# Altium schematic sheet EEPROM.SchDoc: I2C EEprom
size A4; DocumentNumber: 53; SheetNumber: 53; SheetTotal: 54
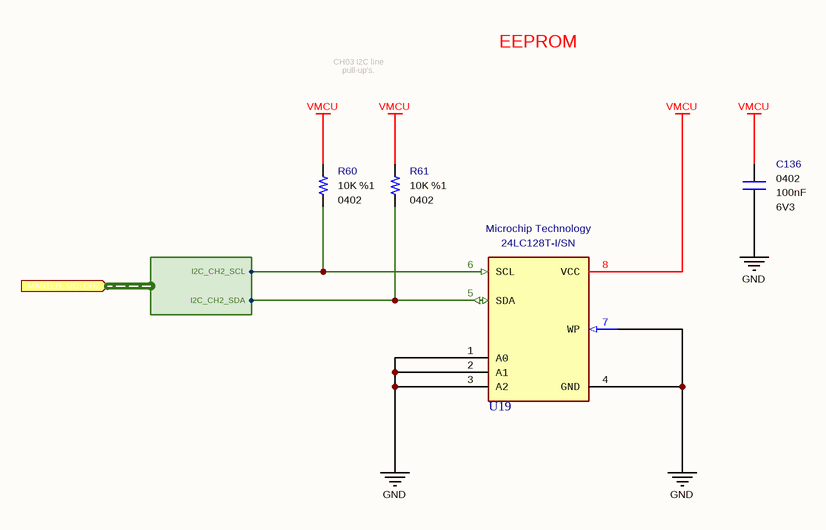
[diagram p0: EEPROM.SchDoc]

## Parts
C136  value 100nF  Case: 0402  Voltage: 6V3  [CAPACITOR_0402]  (hidden comment: Multilayer Ceramic Capacitor)
R60  value 10K  Tolerance: %1  Case: 0402  [RESISTOR_0402]  (hidden comment: Thick Film Resistor)
R61  value 10K  Tolerance: %1  Case: 0402  [RESISTOR_0402]  (hidden comment: Thick Film Resistor)
U19  Manufacturer Part Number: 24LC128T-I/SN  Manufacturer Name: Microchip Technology  [SOIC-8]  (hidden comment: EEPROM)

## Ports
MASTER_I2C_CH2 (in, harness MASTER_I2C_CH2)

## Harnesses
MASTER_I2C_CH2: I2C_CH2_SDA, I2C_CH2_SCL

## Nets
GND: C136.1 U19.1(A0) U19.2(A1) U19.3(A2) U19.4(GND) U19.7(WP)
VMCU: C136.2 R60.2 R61.2 U19.8(VCC)
NetR60_1: R60.1 U19.6(SCL) ; port MASTER_I2C_CH2.I2C_CH2_SCL
NetR61_1: R61.1 U19.5(SDA) ; port MASTER_I2C_CH2.I2C_CH2_SDA

## Notes on the sheet
- EEPROM
- CH03 I2C line pull-up's.
- Engineer
- All Rights are reserved to Customer and Engineer. [2021]
- Size:
- Date:
- A4
- Project :
- Time:
- Sheet
- of
- Customer
- Product ID
- Module ID
- Version
- File:
- Revision

## Library data of the parts
C136 = Capacitor - 100nF [0402-6V3]: Capacitor - 100nF [0402-6V3] (Ceramic); Manufacturer Name: AVX; Manufacturer Part Number: 04026D104KAT4A; Dielectric: X5R; Tolerance: %10; Height: 0.25mm; ComponentLink1Description: Mouser; ComponentLink1URL: https://www.mouser.com.tr/ProductDetail/AVX/04026D104KAT4A?qs=sGAEpiMZZMs0AnBnWHyRQPg4iYkCw7IMED%2F4kpqgf7w%3D; ComponentLink2Description: DataSheet; ComponentLink2URL: https://www.mouser.com.tr/datasheet/2/40/cx5r-776519.pdf; ROHS: Yes; Maximum Operating Temperature: +85; Minimum Operating Temperature: -55; Supplier 1: Avnet; Supplier Part Number 1: 04026D104KAT4A; Mouser Part Number: 581-04026D104KAT4A
R60 R61 = Resistor - 10K: Thick Film Resistors - SMD 1/16 W 10 Kohms 1%; Manufacturer Name: Vishay; Manufacturer Part Number: CRCW040210K0FKED; Height: 0.4mm; ComponentLink1Description: DataSheet; ComponentLink1URL: https://www.mouser.com.tr/datasheet/2/427/dcrcwe3-1762152.pdf; ComponentLink2Description: Mouser; ComponentLink2URL: https://www.mouser.com.tr/ProductDetail/Vishay-Dale/CRCW040210K0FKED?qs=sGAEpiMZZMu61qfTUdNhG2DpbjADlD3GcalbOv9utCY%3D; Supplier 1: Mouser; Supplier 2: Digi-Key; Supplier Part Number 1: 71-CRCW040210K0FKEDH; Supplier Part Number 2: 541-10.0KYCT-ND; Mouser Part Number: 71-CRCW0402-10K-E3
U19 = IC - 24LC128: Case: SOIC-8; RoHS: Yes; ComponentLink1Description: DataSheet; ComponentLink1URL: https://www.mouser.com.tr/datasheet/2/256/DS28CM00-1514106.pdf; ComponentLink2Description: Mouser; ComponentLink2URL: https://www.mouser.com.tr/ProductDetail/Maxim-Integrated/DS28CM00R-A00%2bT/?qs=0Y9aZN%252BMVCUcpogu0Fss%2Fg%3D%3D; Mouser Part Number: 579-24LC128T-I/SN; Supplier 1: Avnet; Supplier 2: Future Electronics; Supplier 3: Arrow Electronics; Supplier 4: Mouser; Supplier 5: Farnell; Supplier 6: Newark; Supplier 7: Digi-Key; Supplier 8: Digi-Key; Supplier Part Number 1: 24LC128T-I/SN; Supplier Part Number 2: 4391603; Supplier Part Number 3: 24LC128T-I/SN; Supplier Part Number 4: 579-24LC128T-I/SN; Supplier Part Number 5: 1296574; Supplier Part Number 6: 25M1950; Supplier Part Number 7: 24LC128T-I/SNCT-ND; Supplier Part Number 8: 24LC128T-I/SNDKR-ND